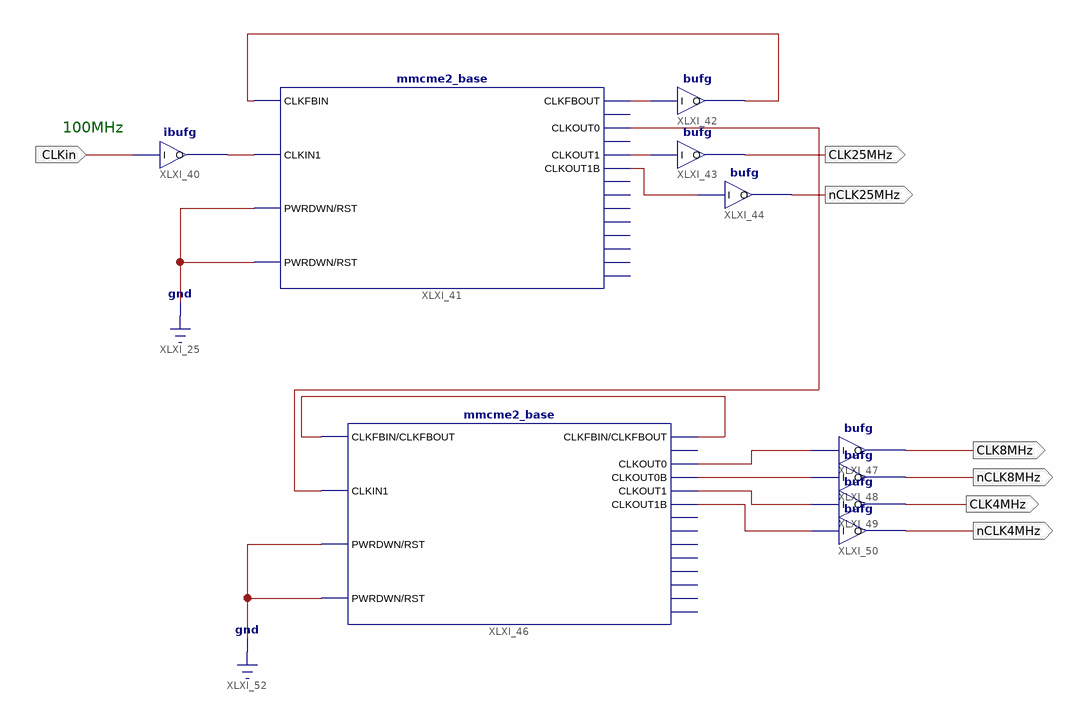
[diagram p0: schematic sheet 1]
// Xilinx ISE schematic divideby6v2.sch (artix7) as structural Verilog: 10 symbols, 7 ports
module divideby6v2 (
  input  CLKin,
  output CLK25MHz,
  output nCLK25MHz,
  output CLK8MHz,
  output nCLK8MHz,
  output CLK4MHz,
  output nCLK4MHz
);

  wire XLXN_81, XLXN_82, XLXN_83, XLXN_84, XLXN_87, XLXN_92, XLXN_93, XLXN_101, XLXN_102, XLXN_103, XLXN_104;

  ibufg XLXI_40 (.I(CLKin), .O(XLXN_81));
  mmcme2_base #(.CLKOUT1_DIVIDE(32), .CLKFBOUT_MULT_F(8.000), .CLKOUT0_DIVIDE_F(96.000)) XLXI_41 (
    .CLKFBIN(XLXN_83), .CLKIN1(XLXN_81), .PWRDWN(1'b0), .RST(1'b0), .CLKFBOUT(XLXN_82), .CLKOUT0(XLXN_92),
    .CLKOUT1(XLXN_84), .CLKOUT1B(XLXN_87));  // open: CLKFBOUTB, CLKOUT0B, CLKOUT2, CLKOUT2B, CLKOUT3, CLKOUT3B, CLKOUT4, CLKOUT5, CLKOUT6, LOCKED
  bufg XLXI_42 (.I(XLXN_82), .O(XLXN_83));
  bufg XLXI_43 (.I(XLXN_84), .O(CLK25MHz));
  bufg XLXI_44 (.I(XLXN_87), .O(nCLK25MHz));
  mmcme2_base #(.CLKOUT1_DIVIDE(16), .CLKOUT0_DIVIDE_F(8.000), .CLKFBOUT_MULT_F(8.000)) XLXI_46 (
    .CLKFBIN(XLXN_93), .CLKIN1(XLXN_92), .PWRDWN(1'b0), .RST(1'b0), .CLKFBOUT(XLXN_93), .CLKOUT0(XLXN_101),
    .CLKOUT0B(XLXN_102), .CLKOUT1(XLXN_103), .CLKOUT1B(XLXN_104));  // open: CLKFBOUTB, CLKOUT2, CLKOUT2B, CLKOUT3, CLKOUT3B, CLKOUT4, CLKOUT5, CLKOUT6, LOCKED
  bufg XLXI_47 (.I(XLXN_101), .O(CLK8MHz));
  bufg XLXI_48 (.I(XLXN_102), .O(nCLK8MHz));
  bufg XLXI_49 (.I(XLXN_103), .O(CLK4MHz));
  bufg XLXI_50 (.I(XLXN_104), .O(nCLK4MHz));

  // Notes on the sheet:
  //   100MHz
endmodule
